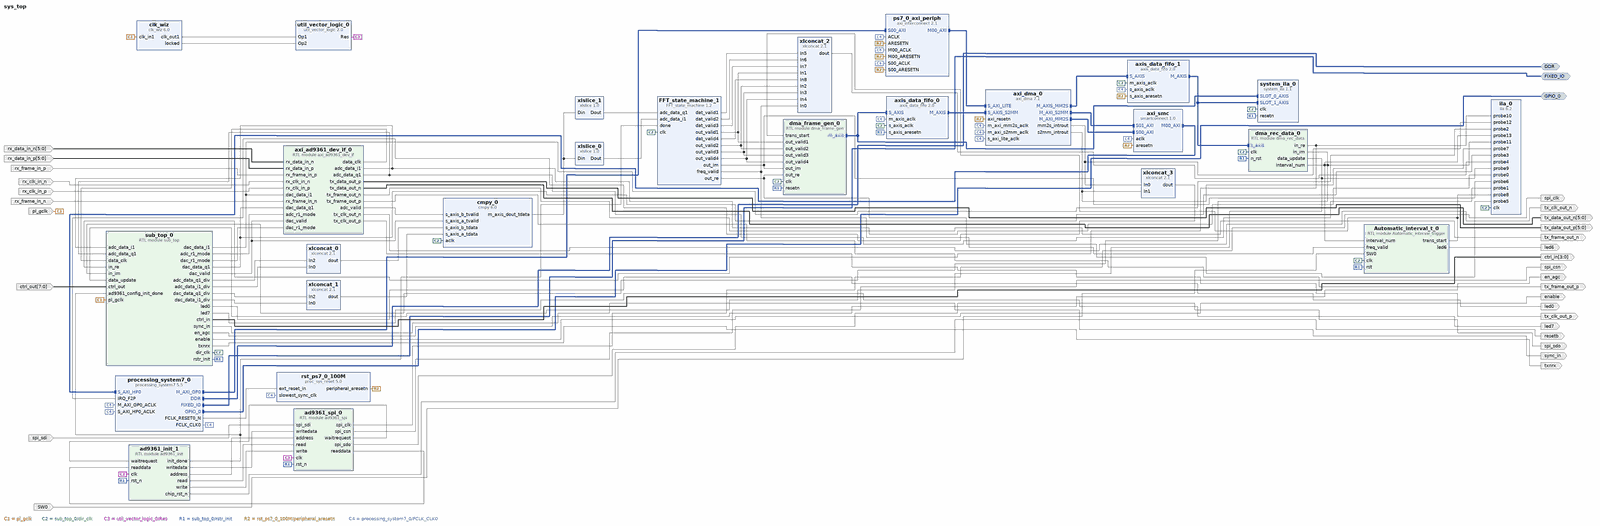
[diagram p0: block diagram of the top level, whole]
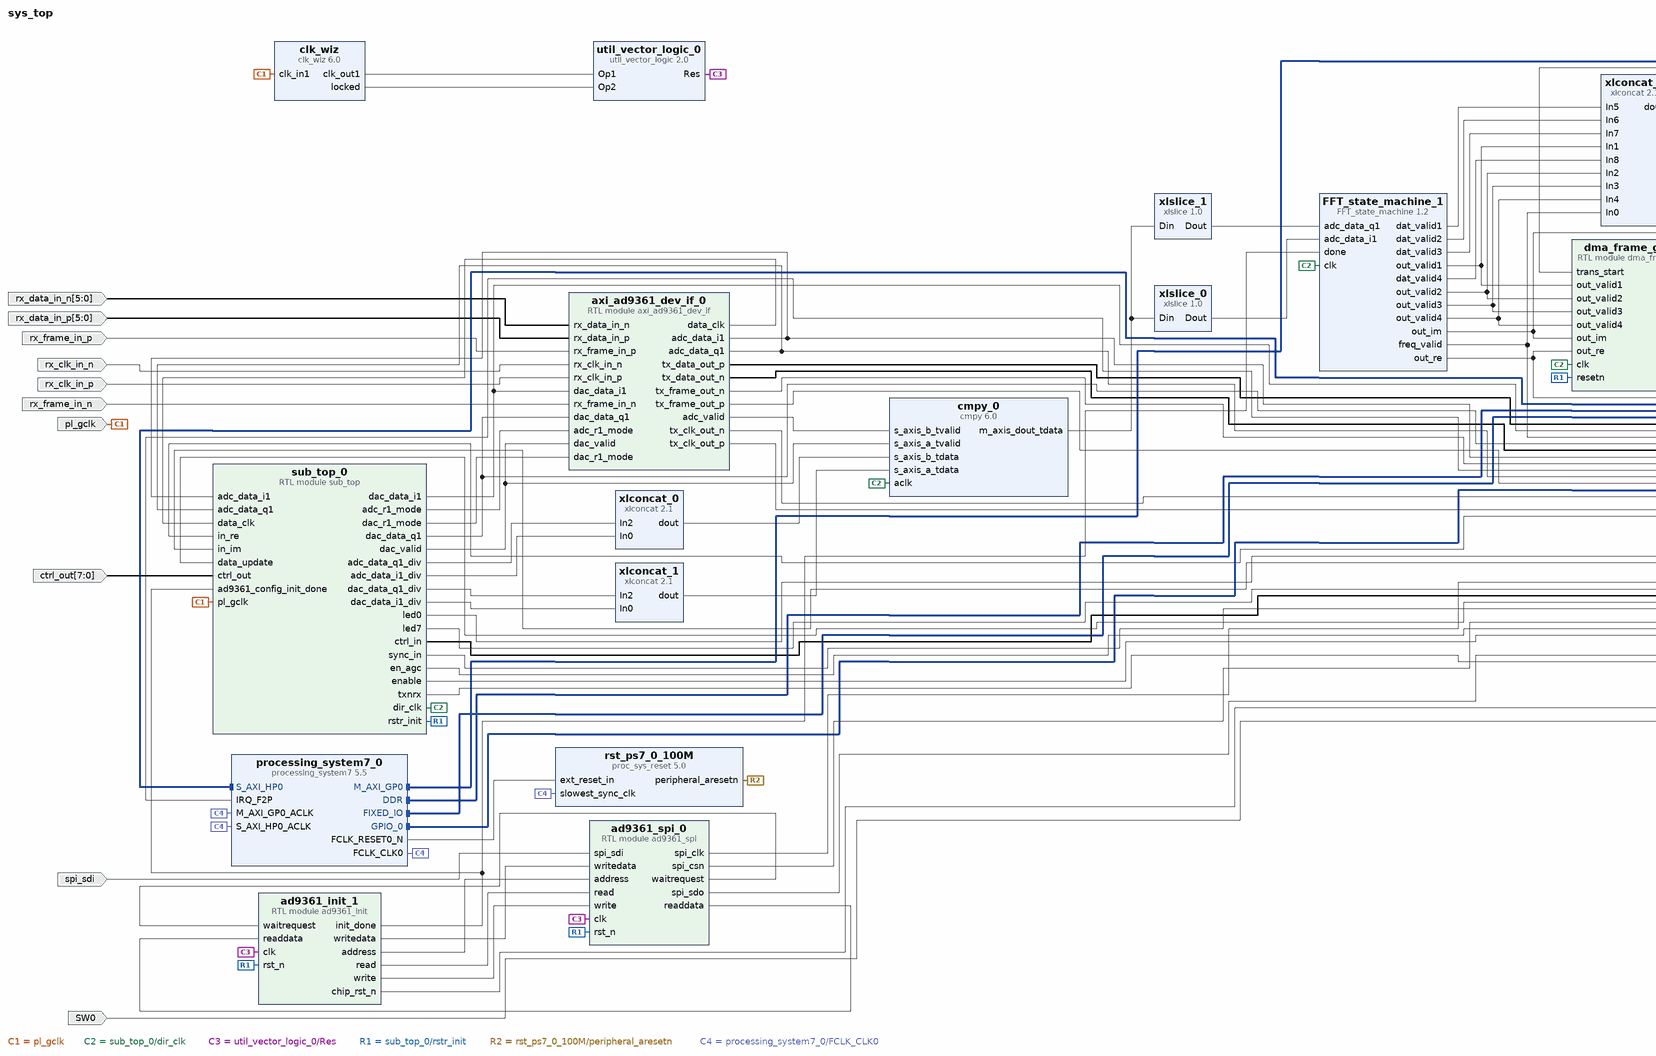
[diagram p1: block diagram of the top level, left part]
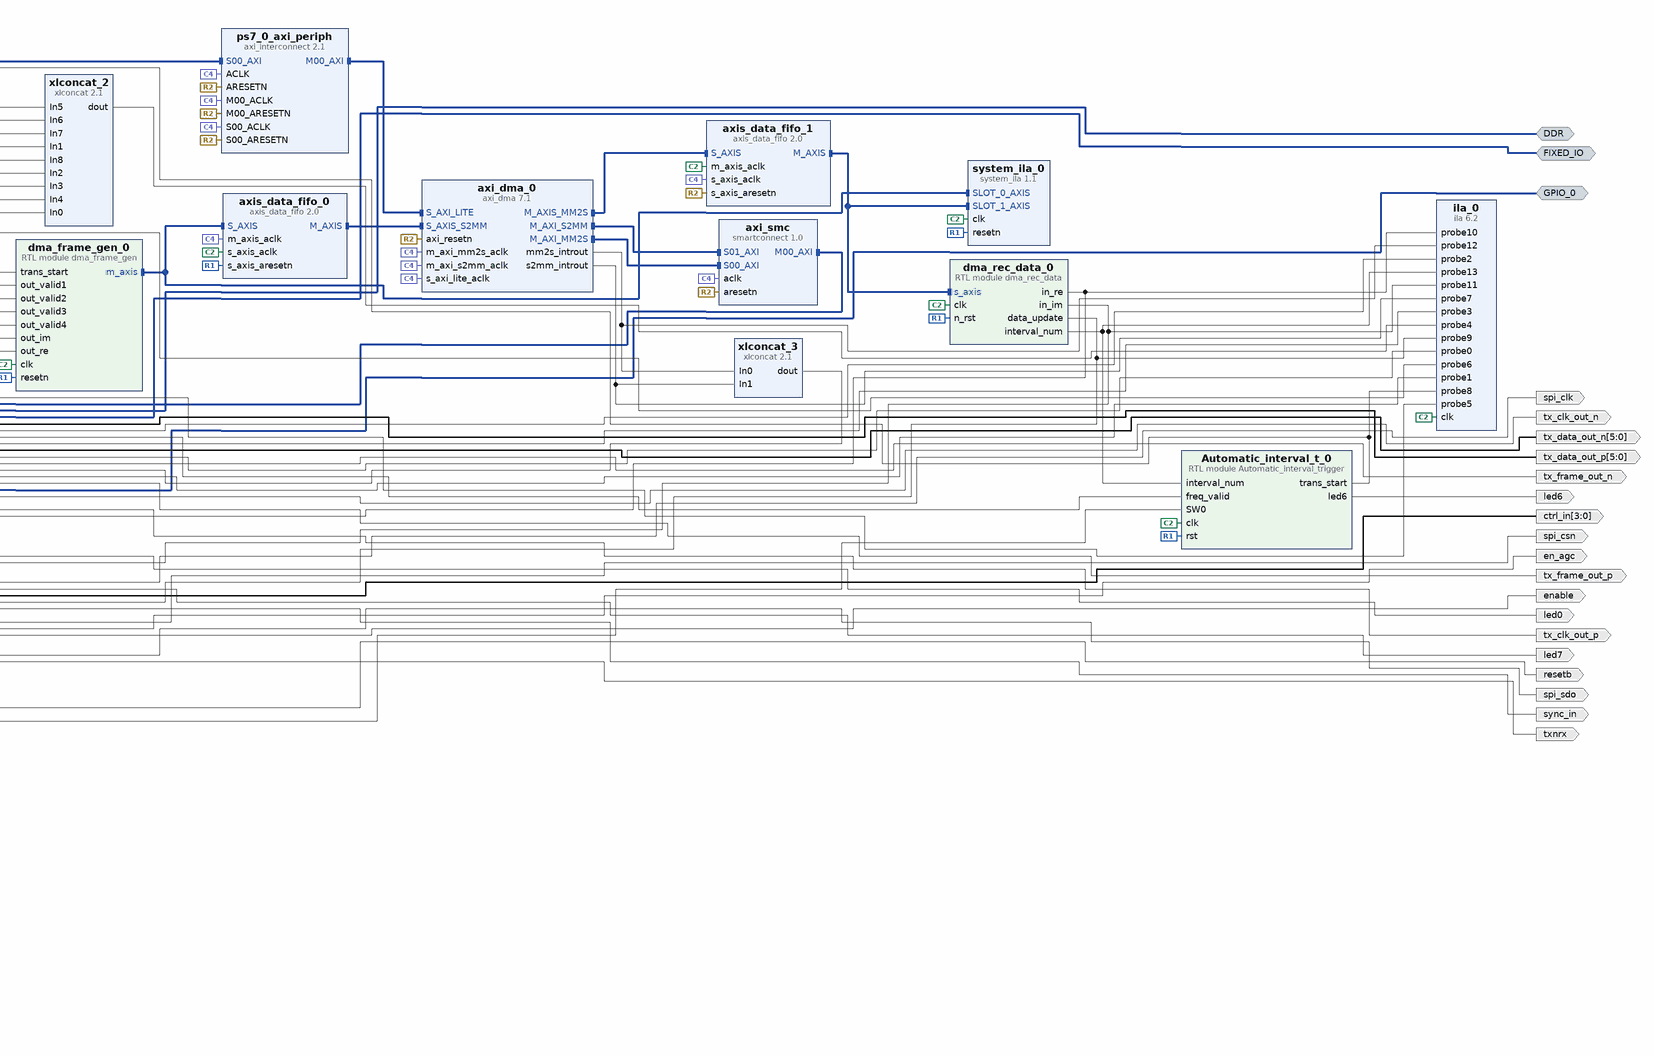
[diagram p2: block diagram of the top level, right part]
# Vivado block design sys_top, xc7z020clg484-1, Vivado 2019.1
create_bd_design sys_top

create_bd_intf_port -mode Master -vlnv xilinx.com:interface:ddrx_rtl:1.0 DDR
create_bd_intf_port -mode Master -vlnv xilinx.com:display_processing_system7:fixedio_rtl:1.0 FIXED_IO
create_bd_intf_port -mode Master -vlnv xilinx.com:interface:gpio_rtl:1.0 GPIO_0
create_bd_port -dir O -from 5 -to 0 tx_data_out_p
create_bd_port -dir O -from 5 -to 0 tx_data_out_n
create_bd_port -dir O tx_frame_out_n
create_bd_port -dir O tx_frame_out_p
create_bd_port -dir O tx_clk_out_n
create_bd_port -dir O tx_clk_out_p
create_bd_port -dir I -from 5 -to 0 rx_data_in_n
create_bd_port -dir I -from 5 -to 0 rx_data_in_p
create_bd_port -dir I rx_frame_in_n
create_bd_port -dir I rx_frame_in_p
create_bd_port -dir I rx_clk_in_n
create_bd_port -dir I rx_clk_in_p
create_bd_port -dir I -type clk pl_gclk
set_property -dict {CONFIG.FREQ_HZ 100000000} [get_bd_ports pl_gclk]
create_bd_port -dir I spi_sdi
create_bd_port -dir O -type clk spi_clk
create_bd_port -dir O spi_csn
create_bd_port -dir O spi_sdo
create_bd_port -dir O led7
create_bd_port -dir O led0
create_bd_port -dir O -type rst resetb
create_bd_port -dir I -from 7 -to 0 ctrl_out
create_bd_port -dir O -from 3 -to 0 ctrl_in
create_bd_port -dir O sync_in
create_bd_port -dir O en_agc
create_bd_port -dir O enable
create_bd_port -dir O txnrx
create_bd_port -dir I SW0
create_bd_port -dir O led6

create_bd_cell -type module -reference ad9361_spi ad9361_spi_0
create_bd_cell -type ip -vlnv xilinx.com:ip:clk_wiz:6.0 clk_wiz
set_property -dict [list \
  CONFIG.CLKOUT1_DRIVES BUFG \
  CONFIG.CLKOUT1_JITTER 397.791 \
  CONFIG.CLKOUT1_PHASE_ERROR 313.282 \
  CONFIG.CLKOUT1_REQUESTED_OUT_FREQ 20.000 \
  CONFIG.CLKOUT2_DRIVES BUFG \
  CONFIG.CLKOUT3_DRIVES BUFG \
  CONFIG.CLKOUT4_DRIVES BUFG \
  CONFIG.CLKOUT5_DRIVES BUFG \
  CONFIG.CLKOUT6_DRIVES BUFG \
  CONFIG.CLKOUT7_DRIVES BUFG \
  CONFIG.MMCM_BANDWIDTH OPTIMIZED \
  CONFIG.MMCM_CLKFBOUT_MULT_F 41 \
  CONFIG.MMCM_CLKOUT0_DIVIDE_F 41 \
  CONFIG.MMCM_COMPENSATION ZHOLD \
  CONFIG.MMCM_DIVCLK_DIVIDE 5 \
  CONFIG.PRIMITIVE PLL \
  CONFIG.PRIM_IN_FREQ 100.000 \
  CONFIG.PRIM_SOURCE Global_buffer \
  CONFIG.USE_RESET false \
] [get_bd_cells clk_wiz]
create_bd_cell -type ip -vlnv xilinx.com:ip:cmpy:6.0 cmpy_0
set_property -dict {CONFIG.APortWidth 12 CONFIG.BPortWidth 12 CONFIG.OutputWidth 25} [get_bd_cells cmpy_0]
create_bd_cell -type ip -vlnv xilinx.com:ip:xlconcat:2.1 xlconcat_0
set_property -dict [list \
  CONFIG.IN0_WIDTH 12 \
  CONFIG.IN1_WIDTH 4 \
  CONFIG.IN2_WIDTH 12 \
  CONFIG.IN3_WIDTH 4 \
  CONFIG.NUM_PORTS 4 \
] [get_bd_cells xlconcat_0]
create_bd_cell -type ip -vlnv xilinx.com:ip:xlconcat:2.1 xlconcat_1
set_property -dict [list \
  CONFIG.IN0_WIDTH 12 \
  CONFIG.IN1_WIDTH 4 \
  CONFIG.IN2_WIDTH 12 \
  CONFIG.IN3_WIDTH 4 \
  CONFIG.NUM_PORTS 4 \
] [get_bd_cells xlconcat_1]
create_bd_cell -type ip -vlnv xilinx.com:ip:xlslice:1.0 xlslice_0
set_property -dict {CONFIG.DIN_FROM 24 CONFIG.DIN_TO 13 CONFIG.DIN_WIDTH 64 CONFIG.DOUT_WIDTH 12} [get_bd_cells xlslice_0]
create_bd_cell -type ip -vlnv xilinx.com:ip:xlslice:1.0 xlslice_1
set_property -dict {CONFIG.DIN_FROM 56 CONFIG.DIN_TO 45 CONFIG.DIN_WIDTH 64 CONFIG.DOUT_WIDTH 12} [get_bd_cells xlslice_1]
create_bd_cell -type ip -vlnv xilinx.com:ip:util_vector_logic:2.0 util_vector_logic_0
set_property -dict {CONFIG.C_SIZE 1} [get_bd_cells util_vector_logic_0]
create_bd_cell -type ip -vlnv xilinx.com:ip:ila:6.2 ila_0
set_property -dict [list \
  CONFIG.C_DATA_DEPTH 8192 \
  CONFIG.C_ENABLE_ILA_AXI_MON false \
  CONFIG.C_MONITOR_TYPE Native \
  CONFIG.C_NUM_OF_PROBES 14 \
  CONFIG.C_PROBE0_WIDTH 12 \
  CONFIG.C_PROBE10_WIDTH 12 \
  CONFIG.C_PROBE11_WIDTH 12 \
  CONFIG.C_PROBE13_WIDTH 8 \
  CONFIG.C_PROBE1_WIDTH 12 \
  CONFIG.C_PROBE2_WIDTH 12 \
  CONFIG.C_PROBE3_WIDTH 12 \
  CONFIG.C_PROBE4_WIDTH 9 \
  CONFIG.C_PROBE5_WIDTH 32 \
  CONFIG.C_PROBE6_WIDTH 32 \
  CONFIG.C_PROBE7_WIDTH 1 \
  CONFIG.C_PROBE8_WIDTH 1 \
  CONFIG.C_PROBE9_WIDTH 1 \
] [get_bd_cells ila_0]
create_bd_cell -type ip -vlnv xilinx.com:ip:xlconcat:2.1 xlconcat_2
set_property -dict [list \
  CONFIG.IN0_WIDTH 1 \
  CONFIG.IN1_WIDTH 1 \
  CONFIG.IN2_WIDTH 1 \
  CONFIG.IN3_WIDTH 1 \
  CONFIG.NUM_PORTS 9 \
] [get_bd_cells xlconcat_2]
create_bd_cell -type module -reference ad9361_init ad9361_init_1
create_bd_cell -type ip -vlnv xilinx.com:ip:processing_system7:5.5 processing_system7_0
set_property -dict [list \
  CONFIG.PCW_APU_PERIPHERAL_FREQMHZ 666.666667 \
  CONFIG.PCW_ENET0_ENET0_IO {MIO 16 .. 27} \
  CONFIG.PCW_ENET0_GRP_MDIO_ENABLE 1 \
  CONFIG.PCW_ENET0_GRP_MDIO_IO {MIO 52 .. 53} \
  CONFIG.PCW_ENET0_PERIPHERAL_ENABLE 1 \
  CONFIG.PCW_ENET0_RESET_ENABLE 0 \
  CONFIG.PCW_ENET_RESET_ENABLE 1 \
  CONFIG.PCW_ENET_RESET_SELECT {Share reset pin} \
  CONFIG.PCW_FPGA0_PERIPHERAL_FREQMHZ 100.000000 \
  CONFIG.PCW_FPGA1_PERIPHERAL_FREQMHZ 150.000000 \
  CONFIG.PCW_GPIO_EMIO_GPIO_ENABLE 1 \
  CONFIG.PCW_GPIO_EMIO_GPIO_IO 1 \
  CONFIG.PCW_GPIO_EMIO_GPIO_WIDTH 1 \
  CONFIG.PCW_GPIO_MIO_GPIO_ENABLE 1 \
  CONFIG.PCW_GPIO_MIO_GPIO_IO MIO \
  CONFIG.PCW_I2C_RESET_ENABLE 1 \
  CONFIG.PCW_IRQ_F2P_INTR 1 \
  CONFIG.PCW_PRESET_BANK1_VOLTAGE {LVCMOS 1.8V} \
  CONFIG.PCW_QSPI_PERIPHERAL_ENABLE 0 \
  CONFIG.PCW_SD0_GRP_CD_ENABLE 1 \
  CONFIG.PCW_SD0_GRP_CD_IO {MIO 47} \
  CONFIG.PCW_SD0_GRP_WP_ENABLE 1 \
  CONFIG.PCW_SD0_GRP_WP_IO {MIO 46} \
  CONFIG.PCW_SD0_PERIPHERAL_ENABLE 1 \
  CONFIG.PCW_SD0_SD0_IO {MIO 40 .. 45} \
  CONFIG.PCW_SDIO_PERIPHERAL_FREQMHZ 50 \
  CONFIG.PCW_UART1_PERIPHERAL_ENABLE 1 \
  CONFIG.PCW_UART1_UART1_IO {MIO 48 .. 49} \
  CONFIG.PCW_UART_PERIPHERAL_FREQMHZ 50 \
  CONFIG.PCW_UIPARAM_DDR_FREQ_MHZ 533.333313 \
  CONFIG.PCW_UIPARAM_DDR_PARTNO {MT41J128M16 HA-15E} \
  CONFIG.PCW_USB0_PERIPHERAL_ENABLE 0 \
  CONFIG.PCW_USB_RESET_ENABLE 0 \
  CONFIG.PCW_USE_FABRIC_INTERRUPT 1 \
  CONFIG.PCW_USE_S_AXI_HP0 1 \
  CONFIG.preset ZedBoard \
] [get_bd_cells processing_system7_0]
# 231 more settings of processing_system7_0 are not shown: defaults, MIO pin electricals, DDR timing, and values the tool derives
create_bd_cell -type ip -vlnv xilinx.com:ip:axi_dma:7.1 axi_dma_0
set_property -dict [list \
  CONFIG.c_include_mm2s 1 \
  CONFIG.c_include_sg 0 \
  CONFIG.c_m_axi_mm2s_data_width 32 \
  CONFIG.c_m_axi_s2mm_data_width 64 \
  CONFIG.c_m_axis_mm2s_tdata_width 32 \
  CONFIG.c_s2mm_burst_size 16 \
  CONFIG.c_sg_length_width 26 \
] [get_bd_cells axi_dma_0]
create_bd_cell -type ip -vlnv xilinx.com:ip:smartconnect:1.0 axi_smc
set_property -dict {CONFIG.NUM_SI 2} [get_bd_cells axi_smc]
create_bd_cell -type ip -vlnv xilinx.com:ip:proc_sys_reset:5.0 rst_ps7_0_100M
create_bd_cell -type ip -vlnv xilinx.com:ip:axi_interconnect:2.1 ps7_0_axi_periph
set_property -dict {CONFIG.NUM_MI 1} [get_bd_cells ps7_0_axi_periph]
create_bd_cell -type ip -vlnv xilinx.com:ip:axis_data_fifo:2.0 axis_data_fifo_0
set_property -dict [list \
  CONFIG.FIFO_DEPTH 8192 \
  CONFIG.HAS_TKEEP 1 \
  CONFIG.HAS_TLAST 1 \
  CONFIG.IS_ACLK_ASYNC 1 \
  CONFIG.SYNCHRONIZATION_STAGES 6 \
  CONFIG.TDATA_NUM_BYTES 8 \
] [get_bd_cells axis_data_fifo_0]
create_bd_cell -type ip -vlnv xilinx.com:ip:system_ila:1.1 system_ila_0
set_property -dict [list \
  CONFIG.C_DATA_DEPTH 8192 \
  CONFIG.C_MON_TYPE INTERFACE \
  CONFIG.C_NUM_MONITOR_SLOTS 2 \
  CONFIG.C_SLOT_0_APC_EN 0 \
  CONFIG.C_SLOT_0_AXI_DATA_SEL 1 \
  CONFIG.C_SLOT_0_AXI_TRIG_SEL 1 \
  CONFIG.C_SLOT_0_INTF_TYPE xilinx.com:interface:axis_rtl:1.0 \
  CONFIG.C_SLOT_1_APC_EN 0 \
  CONFIG.C_SLOT_1_AXI_DATA_SEL 1 \
  CONFIG.C_SLOT_1_AXI_TRIG_SEL 1 \
  CONFIG.C_SLOT_1_INTF_TYPE xilinx.com:interface:axis_rtl:1.0 \
] [get_bd_cells system_ila_0]
create_bd_cell -type ip -vlnv xilinx.com:ip:xlconcat:2.1 xlconcat_3
set_property -dict {CONFIG.NUM_PORTS 2} [get_bd_cells xlconcat_3]
create_bd_cell -type module -reference dma_frame_gen dma_frame_gen_0
create_bd_cell -type ip -vlnv xilinx.com:user:FFT_state_machine:1.2 FFT_state_machine_1
create_bd_cell -type ip -vlnv xilinx.com:ip:axis_data_fifo:2.0 axis_data_fifo_1
set_property -dict [list \
  CONFIG.FIFO_DEPTH 512 \
  CONFIG.HAS_TKEEP 1 \
  CONFIG.HAS_TLAST 1 \
  CONFIG.IS_ACLK_ASYNC 1 \
  CONFIG.SYNCHRONIZATION_STAGES 6 \
  CONFIG.TDATA_NUM_BYTES 4 \
] [get_bd_cells axis_data_fifo_1]
create_bd_cell -type module -reference sub_top sub_top_0
create_bd_cell -type module -reference Automatic_interval_trigger Automatic_interval_t_0
create_bd_cell -type module -reference dma_rec_data dma_rec_data_0
create_bd_cell -type module -reference axi_ad9361_dev_if axi_ad9361_dev_if_0

# ---- connections ----

connect_bd_intf_net [get_bd_intf_ports DDR] [get_bd_intf_pins processing_system7_0/DDR]
connect_bd_intf_net -intf_net axis_data_fifo_1_M_AXIS [get_bd_intf_pins axis_data_fifo_1/M_AXIS] [get_bd_intf_pins dma_rec_data_0/s_axis]
connect_bd_intf_net [get_bd_intf_pins axis_data_fifo_1/M_AXIS] [get_bd_intf_pins system_ila_0/SLOT_1_AXIS]
connect_bd_intf_net [get_bd_intf_pins axi_dma_0/M_AXI_S2MM] [get_bd_intf_pins axi_smc/S01_AXI]
connect_bd_intf_net -intf_net dma_frame_gen_0_m_axis [get_bd_intf_pins dma_frame_gen_0/m_axis] [get_bd_intf_pins axis_data_fifo_0/S_AXIS]
connect_bd_intf_net [get_bd_intf_pins dma_frame_gen_0/m_axis] [get_bd_intf_pins system_ila_0/SLOT_0_AXIS]
connect_bd_intf_net [get_bd_intf_ports FIXED_IO] [get_bd_intf_pins processing_system7_0/FIXED_IO]
connect_bd_intf_net [get_bd_intf_ports GPIO_0] [get_bd_intf_pins processing_system7_0/GPIO_0]
connect_bd_intf_net [get_bd_intf_pins axi_smc/M00_AXI] [get_bd_intf_pins processing_system7_0/S_AXI_HP0]
connect_bd_intf_net [get_bd_intf_pins processing_system7_0/M_AXI_GP0] [get_bd_intf_pins ps7_0_axi_periph/S00_AXI]
connect_bd_intf_net [get_bd_intf_pins ps7_0_axi_periph/M00_AXI] [get_bd_intf_pins axi_dma_0/S_AXI_LITE]
connect_bd_intf_net [get_bd_intf_pins axi_dma_0/M_AXI_MM2S] [get_bd_intf_pins axi_smc/S00_AXI]
connect_bd_intf_net [get_bd_intf_pins axi_dma_0/M_AXIS_MM2S] [get_bd_intf_pins axis_data_fifo_1/S_AXIS]
connect_bd_intf_net [get_bd_intf_pins axi_dma_0/S_AXIS_S2MM] [get_bd_intf_pins axis_data_fifo_0/M_AXIS]
connect_bd_net [get_bd_pins axi_ad9361_dev_if_0/tx_data_out_p] [get_bd_ports tx_data_out_p]
connect_bd_net [get_bd_pins axi_ad9361_dev_if_0/tx_data_out_n] [get_bd_ports tx_data_out_n]
connect_bd_net [get_bd_pins axi_ad9361_dev_if_0/tx_frame_out_n] [get_bd_ports tx_frame_out_n]
connect_bd_net [get_bd_pins axi_ad9361_dev_if_0/tx_frame_out_p] [get_bd_ports tx_frame_out_p]
connect_bd_net [get_bd_pins axi_ad9361_dev_if_0/tx_clk_out_n] [get_bd_ports tx_clk_out_n]
connect_bd_net [get_bd_pins axi_ad9361_dev_if_0/tx_clk_out_p] [get_bd_ports tx_clk_out_p]
connect_bd_net [get_bd_ports rx_data_in_n] [get_bd_pins axi_ad9361_dev_if_0/rx_data_in_n]
connect_bd_net [get_bd_ports rx_data_in_p] [get_bd_pins axi_ad9361_dev_if_0/rx_data_in_p]
connect_bd_net [get_bd_ports rx_frame_in_p] [get_bd_pins axi_ad9361_dev_if_0/rx_frame_in_p]
connect_bd_net [get_bd_ports rx_clk_in_n] [get_bd_pins axi_ad9361_dev_if_0/rx_clk_in_n]
connect_bd_net [get_bd_ports rx_clk_in_p] [get_bd_pins axi_ad9361_dev_if_0/rx_clk_in_p]
connect_bd_net [get_bd_pins ad9361_spi_0/waitrequest] [get_bd_pins ad9361_init_1/waitrequest]
connect_bd_net [get_bd_ports spi_sdi] [get_bd_pins ad9361_spi_0/spi_sdi]
connect_bd_net [get_bd_pins ad9361_spi_0/spi_clk] [get_bd_ports spi_clk]
connect_bd_net [get_bd_pins ad9361_spi_0/spi_csn] [get_bd_ports spi_csn]
connect_bd_net [get_bd_pins ad9361_spi_0/spi_sdo] [get_bd_ports spi_sdo]
connect_bd_net [get_bd_pins ad9361_spi_0/readdata] [get_bd_pins ad9361_init_1/readdata]
connect_bd_net [get_bd_ports pl_gclk] [get_bd_pins clk_wiz/clk_in1] [get_bd_pins sub_top_0/pl_gclk]
connect_bd_net [get_bd_pins sub_top_0/dac_data_i1] [get_bd_pins ila_0/probe2] [get_bd_pins axi_ad9361_dev_if_0/dac_data_i1]
connect_bd_net [get_bd_pins sub_top_0/dac_data_q1] [get_bd_pins ila_0/probe3] [get_bd_pins axi_ad9361_dev_if_0/dac_data_q1]
connect_bd_net [get_bd_pins sub_top_0/dac_valid] [get_bd_pins cmpy_0/s_axis_a_tvalid] [get_bd_pins axi_ad9361_dev_if_0/dac_valid]
connect_bd_net [get_bd_pins sub_top_0/dir_clk] \
  [get_bd_pins cmpy_0/aclk] [get_bd_pins ila_0/clk] [get_bd_pins axis_data_fifo_0/s_axis_aclk] [get_bd_pins system_ila_0/clk] \
  [get_bd_pins dma_frame_gen_0/clk] [get_bd_pins FFT_state_machine_1/clk] [get_bd_pins axis_data_fifo_1/m_axis_aclk] \
  [get_bd_pins Automatic_interval_t_0/clk] [get_bd_pins dma_rec_data_0/clk]
connect_bd_net [get_bd_pins xlconcat_0/dout] [get_bd_pins cmpy_0/s_axis_b_tdata]
connect_bd_net [get_bd_pins xlconcat_1/dout] [get_bd_pins cmpy_0/s_axis_a_tdata]
connect_bd_net [get_bd_pins cmpy_0/m_axis_dout_tdata] [get_bd_pins xlslice_1/Din] [get_bd_pins xlslice_0/Din]
connect_bd_net [get_bd_pins axi_ad9361_dev_if_0/adc_data_i1] [get_bd_pins ila_0/probe0] [get_bd_pins sub_top_0/adc_data_i1]
connect_bd_net [get_bd_pins axi_ad9361_dev_if_0/adc_data_q1] [get_bd_pins ila_0/probe1] [get_bd_pins sub_top_0/adc_data_q1]
connect_bd_net [get_bd_pins util_vector_logic_0/Res] [get_bd_pins ad9361_spi_0/clk] [get_bd_pins ad9361_init_1/clk]
connect_bd_net [get_bd_pins ad9361_init_1/init_done] [get_bd_pins FFT_state_machine_1/done] [get_bd_pins sub_top_0/ad9361_config_init_done]
connect_bd_net [get_bd_pins ad9361_init_1/chip_rst_n] [get_bd_ports resetb]
connect_bd_net [get_bd_pins ad9361_init_1/writedata] [get_bd_pins ad9361_spi_0/writedata]
connect_bd_net [get_bd_pins ad9361_init_1/address] [get_bd_pins ad9361_spi_0/address]
connect_bd_net [get_bd_pins ad9361_init_1/read] [get_bd_pins ad9361_spi_0/read]
connect_bd_net [get_bd_pins ad9361_init_1/write] [get_bd_pins ad9361_spi_0/write]
connect_bd_net [get_bd_ports rx_frame_in_n] [get_bd_pins axi_ad9361_dev_if_0/rx_frame_in_n]
connect_bd_net [get_bd_pins sub_top_0/led0] [get_bd_ports led0]
connect_bd_net [get_bd_pins sub_top_0/led7] [get_bd_ports led7]
connect_bd_net [get_bd_pins sub_top_0/adc_r1_mode] [get_bd_pins axi_ad9361_dev_if_0/adc_r1_mode]
connect_bd_net [get_bd_pins sub_top_0/dac_r1_mode] [get_bd_pins axi_ad9361_dev_if_0/dac_r1_mode]
connect_bd_net [get_bd_ports ctrl_out] [get_bd_pins sub_top_0/ctrl_out]
connect_bd_net [get_bd_pins sub_top_0/ctrl_in] [get_bd_ports ctrl_in]
connect_bd_net [get_bd_pins sub_top_0/rstr_init] \
  [get_bd_pins ad9361_spi_0/rst_n] [get_bd_pins ad9361_init_1/rst_n] [get_bd_pins axis_data_fifo_0/s_axis_aresetn] \
  [get_bd_pins system_ila_0/resetn] [get_bd_pins dma_frame_gen_0/resetn] [get_bd_pins Automatic_interval_t_0/rst] \
  [get_bd_pins dma_rec_data_0/n_rst]
connect_bd_net [get_bd_pins sub_top_0/sync_in] [get_bd_ports sync_in]
connect_bd_net [get_bd_pins sub_top_0/en_agc] [get_bd_ports en_agc]
connect_bd_net [get_bd_pins sub_top_0/enable] [get_bd_ports enable]
connect_bd_net [get_bd_pins sub_top_0/txnrx] [get_bd_ports txnrx]
connect_bd_net [get_bd_pins axi_ad9361_dev_if_0/data_clk] [get_bd_pins sub_top_0/data_clk]
connect_bd_net [get_bd_pins axi_ad9361_dev_if_0/adc_valid] [get_bd_pins cmpy_0/s_axis_b_tvalid]
connect_bd_net [get_bd_pins sub_top_0/adc_data_q1_div] [get_bd_pins xlconcat_0/In2]
connect_bd_net [get_bd_pins sub_top_0/adc_data_i1_div] [get_bd_pins xlconcat_0/In0]
connect_bd_net [get_bd_pins sub_top_0/dac_data_q1_div] [get_bd_pins xlconcat_1/In2]
connect_bd_net [get_bd_pins sub_top_0/dac_data_i1_div] [get_bd_pins xlconcat_1/In0]
connect_bd_net [get_bd_pins xlslice_0/Dout] [get_bd_pins FFT_state_machine_1/adc_data_i1]
connect_bd_net [get_bd_pins xlslice_1/Dout] [get_bd_pins FFT_state_machine_1/adc_data_q1]
connect_bd_net [get_bd_pins clk_wiz/clk_out1] [get_bd_pins util_vector_logic_0/Op1]
connect_bd_net [get_bd_pins clk_wiz/locked] [get_bd_pins util_vector_logic_0/Op2]
connect_bd_net [get_bd_pins FFT_state_machine_1/out_im] [get_bd_pins ila_0/probe6] [get_bd_pins dma_frame_gen_0/out_im]
connect_bd_net [get_bd_pins FFT_state_machine_1/freq_valid] [get_bd_pins xlconcat_2/In0] [get_bd_pins Automatic_interval_t_0/freq_valid]
connect_bd_net [get_bd_pins FFT_state_machine_1/out_valid1] [get_bd_pins xlconcat_2/In1] [get_bd_pins dma_frame_gen_0/out_valid1]
connect_bd_net [get_bd_pins FFT_state_machine_1/out_valid2] [get_bd_pins xlconcat_2/In2] [get_bd_pins dma_frame_gen_0/out_valid2]
connect_bd_net [get_bd_pins FFT_state_machine_1/out_valid3] [get_bd_pins xlconcat_2/In3] [get_bd_pins dma_frame_gen_0/out_valid3]
connect_bd_net [get_bd_pins FFT_state_machine_1/out_valid4] [get_bd_pins xlconcat_2/In4] [get_bd_pins dma_frame_gen_0/out_valid4]
connect_bd_net [get_bd_pins FFT_state_machine_1/dat_valid1] [get_bd_pins xlconcat_2/In5]
connect_bd_net [get_bd_pins FFT_state_machine_1/dat_valid2] [get_bd_pins xlconcat_2/In6]
connect_bd_net [get_bd_pins FFT_state_machine_1/dat_valid3] [get_bd_pins xlconcat_2/In7]
connect_bd_net [get_bd_pins FFT_state_machine_1/dat_valid4] [get_bd_pins xlconcat_2/In8]
connect_bd_net [get_bd_pins processing_system7_0/FCLK_RESET0_N] [get_bd_pins rst_ps7_0_100M/ext_reset_in]
connect_bd_net [get_bd_pins xlconcat_2/dout] [get_bd_pins ila_0/probe4]
connect_bd_net [get_bd_pins FFT_state_machine_1/out_re] [get_bd_pins ila_0/probe5] [get_bd_pins dma_frame_gen_0/out_re]
connect_bd_net [get_bd_pins rst_ps7_0_100M/peripheral_aresetn] \
  [get_bd_pins axi_smc/aresetn] [get_bd_pins ps7_0_axi_periph/S00_ARESETN] [get_bd_pins axi_dma_0/axi_resetn] \
  [get_bd_pins ps7_0_axi_periph/M00_ARESETN] [get_bd_pins ps7_0_axi_periph/ARESETN] \
  [get_bd_pins axis_data_fifo_1/s_axis_aresetn]
connect_bd_net [get_bd_pins processing_system7_0/FCLK_CLK0] \
  [get_bd_pins axi_smc/aclk] [get_bd_pins processing_system7_0/S_AXI_HP0_ACLK] [get_bd_pins rst_ps7_0_100M/slowest_sync_clk] \
  [get_bd_pins processing_system7_0/M_AXI_GP0_ACLK] [get_bd_pins ps7_0_axi_periph/S00_ACLK] \
  [get_bd_pins axi_dma_0/s_axi_lite_aclk] [get_bd_pins ps7_0_axi_periph/M00_ACLK] [get_bd_pins ps7_0_axi_periph/ACLK] \
  [get_bd_pins axi_dma_0/m_axi_s2mm_aclk] [get_bd_pins axis_data_fifo_0/m_axis_aclk] [get_bd_pins axi_dma_0/m_axi_mm2s_aclk] \
  [get_bd_pins axis_data_fifo_1/s_axis_aclk]
connect_bd_net [get_bd_pins axi_dma_0/mm2s_introut] [get_bd_pins xlconcat_3/In0] [get_bd_pins ila_0/probe12]
connect_bd_net [get_bd_pins axi_dma_0/s2mm_introut] [get_bd_pins xlconcat_3/In1] [get_bd_pins ila_0/probe7]
connect_bd_net [get_bd_pins xlconcat_3/dout] [get_bd_pins processing_system7_0/IRQ_F2P]
connect_bd_net [get_bd_pins Automatic_interval_t_0/trans_start] [get_bd_pins dma_frame_gen_0/trans_start] [get_bd_pins ila_0/probe8]
connect_bd_net [get_bd_pins dma_rec_data_0/in_re] [get_bd_pins sub_top_0/in_re] [get_bd_pins ila_0/probe10]
connect_bd_net [get_bd_pins dma_rec_data_0/in_im] [get_bd_pins sub_top_0/in_im] [get_bd_pins ila_0/probe11]
connect_bd_net [get_bd_pins dma_rec_data_0/data_update] [get_bd_pins sub_top_0/data_update] [get_bd_pins ila_0/probe9]
connect_bd_net -net SW0_1 [get_bd_ports SW0] [get_bd_pins Automatic_interval_t_0/SW0]
connect_bd_net [get_bd_pins Automatic_interval_t_0/led6] [get_bd_ports led6]
connect_bd_net [get_bd_pins dma_rec_data_0/interval_num] [get_bd_pins Automatic_interval_t_0/interval_num] [get_bd_pins ila_0/probe13]
set_property HDL_ATTRIBUTE.DEBUG true [get_bd_intf_nets axis_data_fifo_1_M_AXIS]
set_property HDL_ATTRIBUTE.MARK_DEBUG true [get_bd_intf_nets axis_data_fifo_1_M_AXIS]
set_property HDL_ATTRIBUTE.DEBUG true [get_bd_intf_nets dma_frame_gen_0_m_axis]
set_property HDL_ATTRIBUTE.MARK_DEBUG true [get_bd_intf_nets dma_frame_gen_0_m_axis]

# ---- address map ----
assign_bd_address -offset 0x00000000 -range 512M -target_address_space [get_bd_addr_spaces axi_dma_0/Data_MM2S] [get_bd_addr_segs processing_system7_0/S_AXI_HP0/HP0_DDR_LOWOCM]
assign_bd_address -offset 0x00000000 -range 512M -target_address_space [get_bd_addr_spaces axi_dma_0/Data_S2MM] [get_bd_addr_segs processing_system7_0/S_AXI_HP0/HP0_DDR_LOWOCM]
assign_bd_address -offset 0x40400000 -range 64K -target_address_space [get_bd_addr_spaces processing_system7_0/Data] [get_bd_addr_segs axi_dma_0/S_AXI_LITE/Reg]

validate_bd_design
save_bd_design
